# Altium schematic sheet IRF7317+TC4427.SchDoc
size A4
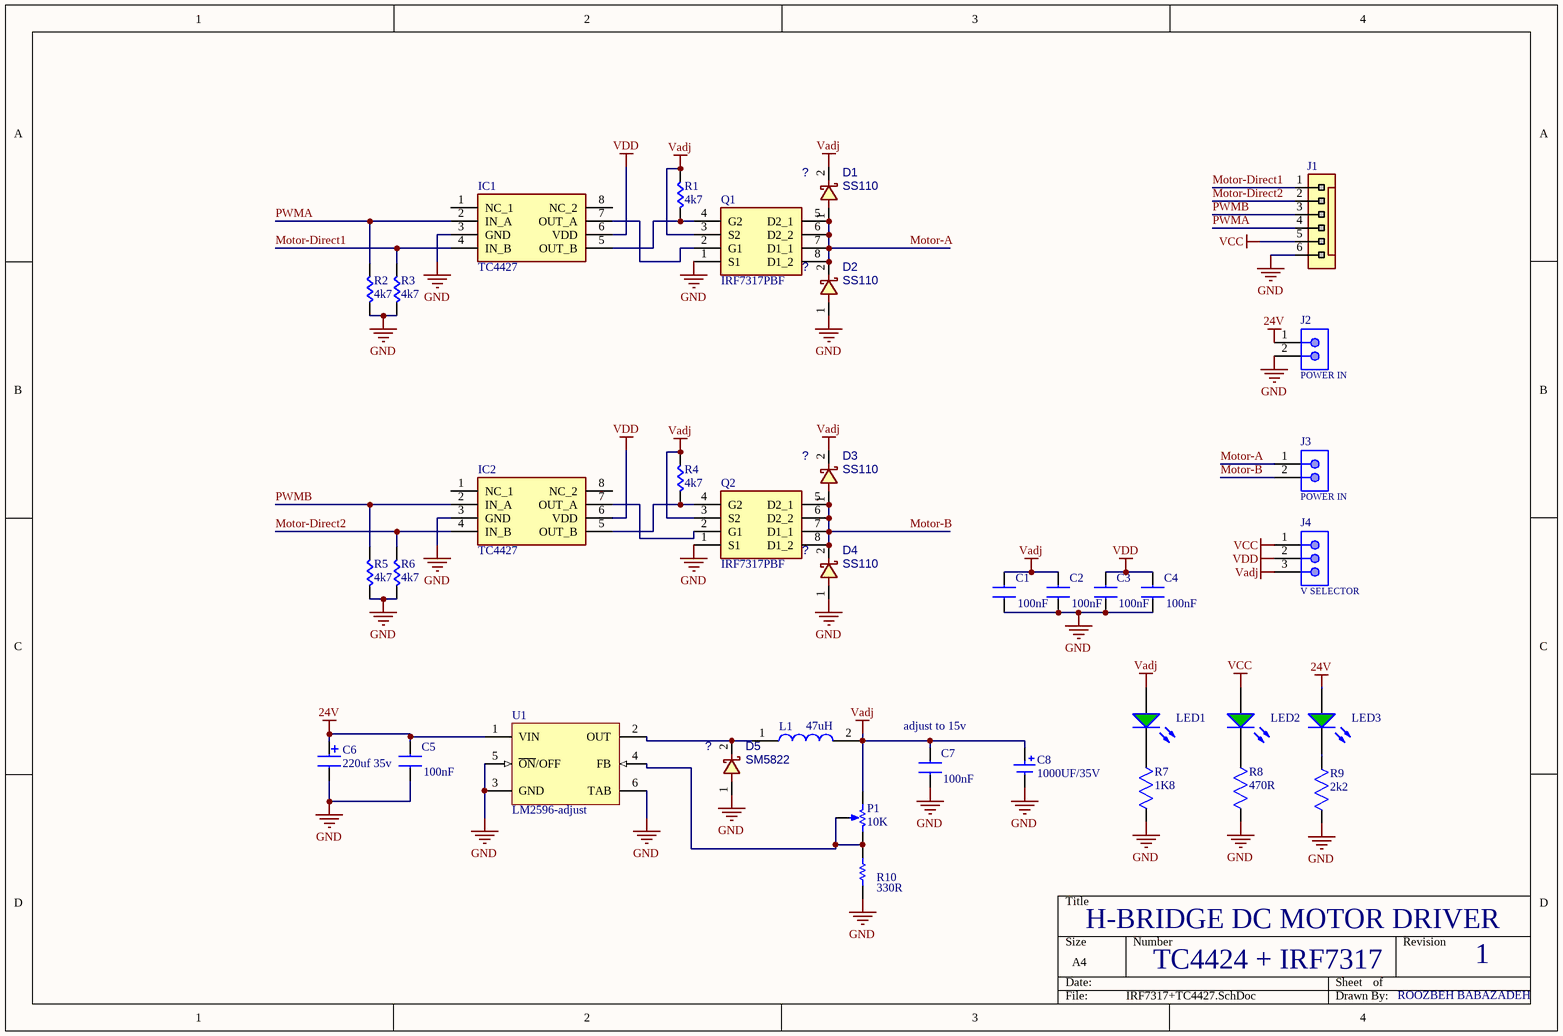
[diagram p0: IRF7317+TC4427.SchDoc]

## Parts
C1  100nF  [C0805]
C2  100nF  [C0805]
C3  100nF  [C0805]
C4  100nF  [C0805]
C5  100nF  [C0805]
C6  220uf 35v  [C_EL_10X12]
C7  100nF  [C0805]
C8  1000UF/35V  [C_EL_12X25]
D1  SS110  [D_SMA]
D2  SS110  [D_SMA]
D3  SS110  [D_SMA]
D4  SS110  [D_SMA]
D5  SM5822  [D_SMB]
IC1  TC4427  [SO_8]
IC2  TC4427  [SO_8]
J1  HDRWF_6  [WF_6]  (value not drawn)
J2  POWER IN  [PWL_2]
J3  POWER IN  [PWL_2]
J4  V SELECTOR  [3_SIP]
L1  47uH  [CDRH127LDNP560MC-12*12]
LED1  (no value)  [LED1206RED]
LED2  (no value)  [LED1206RED]
LED3  (no value)  [LED1206RED]
P1  10K  [POT_3296W]
Q1  IRF7317PBF  [SO_8]
Q2  IRF7317PBF  [SO_8]
R1  4k7  [R0805]
R2  4k7  [R0805]
R3  4k7  [R0805]
R4  4k7  [R0805]
R5  4k7  [R0805]
R6  4k7  [R0805]
R7  1K8  [R0805]
R8  470R  [R0805]
R9  2k2  [R0805]
R10  330R  [R0805]
U1  LM2596-adjust  [to-263-5 5d2pak LM2596S]

## Nets
24V: C5.2 C6.1 J2.1 LED3.1(A) U1.1(VIN)
GND: C1.1 C2.1 C3.1 C4.1 C5.1 C6.2 C7.1 C8.2 D2.1 D4.1 D5.1 IC1.3(GND) IC2.3(GND) J1.6 J2.2 Q1.1(S1) Q2.1(S1) R2.2 R3.2 R5.2 R6.2 R7.2 R8.2 R9.2 R10.1 U1.3(GND) U1.5(~{ON}/OFF) U1.6(TAB)
Vadj: C1.2 C2.2 C7.2 C8.1 D1.2 D3.2 J4.3 L1.2 LED1.1(A) P1.3(BOT) Q1.3(S2) Q2.3(S2) R1.1 R4.1
VCC: J1.5 J4.1 LED2.1(A)
VDD: C3.2 C4.2 IC1.6(VDD) IC2.6(VDD) J4.2
Motor-A: D1.1 D2.2 J3.1 Q1.5(D2_1) Q1.6(D2_2) Q1.7(D1_1) Q1.8(D1_2)
Motor-B: D3.1 D4.2 J3.2 Q2.5(D2_1) Q2.6(D2_2) Q2.7(D1_1) Q2.8(D1_2)
Motor-Direct1: IC1.4(IN_B) J1.1 R3.1
Motor-Direct2: IC2.4(IN_B) J1.2 R6.1
PWMA: IC1.2(IN_A) J1.4 R2.1
PWMB: IC2.2(IN_A) J1.3 R5.1
NetD5_2: D5.2 L1.1 U1.2(OUT)
NetIC1_5: IC1.5(OUT_B) Q1.4(G2) R1.2
NetIC1_7: IC1.7(OUT_A) Q1.2(G1)
NetIC2_5: IC2.5(OUT_B) Q2.4(G2) R4.2
NetIC2_7: IC2.7(OUT_A) Q2.2(G1)
NetLED1_2: LED1.2(K) R7.1
NetLED2_2: LED2.2(K) R8.1
NetLED3_2: LED3.2(K) R9.1
NetP1_1: P1.1(TOP) P1.2(TAP) R10.2 U1.4(FB)

Not connected (* = marked no-connect by the designer): IC1 1(NC_1) 8(NC_2); IC2 1(NC_1) 8(NC_2)

## Notes on the sheet
- (near C7) adjust to 15v
- H-BRIDGE DC MOTOR DRIVER
- TC4424 + IRF7317
- 1
- ROOZBEH BABAZADEH

## Library data of the parts
C1-C5 C7 = C
C6 = CAP3528
C8 = CAP_ELECTRO_POLIMER
D1-D5 = SCHOTTKY: DIODE, SCHOTTKY, 40V, 1A; MANF: DIODES; MANF_P#: 1N5819HW-7-F; DESC: DESCRIPTION; ASSEMBLY: ASSEMBLY; PRICE: PRICE; PARAM2: 1A; PARAM: 40V; VALUE: ?
IC1 IC2 = TC4427EOA713: Integrated Circuit; Manufacturer_Name: Microchip; Datasheet Link: http://www.microchip.com/mymicrochip/filehandler.aspx?ddocname=en011741; Height: 1.75mm; Manufacturer_Part_Number: TC4427EOA713; Arrow Part Number: TC4427EOA713; Arrow Price/Stock: https://www.arrow.com/en/products/tc4427eoa713/microchip-technology; Mouser Part Number: 579-TC4427EOA713; Mouser Price/Stock: https://www.mouser.co.uk/ProductDetail/Microchip-Technology/TC4427EOA713?qs=iwvYsH9bSFbKmD8r5x5IJg%3D%3D
J1 = HDRWF_6: Header, WF, Pitch: 2.54mm; VALUE: HDRWF_6
J2 J3 = sip 2: WR-PHD Pin Header, THT, pitch 2.54mm, Single Row, Vertical, 2pin; Part Number: 61300211121; Pin Number: 2; Gender: Male; Rated Current: 3A; Working Voltage: 250VAC; Withstanding Voltage: 500VAC; Contact Resistance: 20mOhm; ComponentLink1Description: Manufacturer; ComponentLink1URL: http://www.we-online.de; ComponentLink2Description: Datasheet; ComponentLink2URL: https://katalog.we-online.de/em/datasheet/6130xx11121.pdf; Published Date: June 2019; Publisher: Wurth Elektronik; Pitch: 2.54mm; Operating Temperature: -40 to +105degC; Mounting Technology: THT; Packaging: Bag; Row Number: Single; Orientation: Vertical
J4 = sip 3: WR-PHD Pin Header, THT, pitch 2.54mm, Single Row, Vertical, 3pin; Part Number: 61300311121; Pin Number: 3; Gender: Male; Rated Current: 3A; Working Voltage: 250VAC; Withstanding Voltage: 500VAC; Contact Resistance: 20mOhm; ComponentLink1Description: Manufacturer; ComponentLink1URL: http://www.we-online.de; ComponentLink2Description: Datasheet; ComponentLink2URL: https://katalog.we-online.de/em/datasheet/6130xx11121.pdf; Published Date: June 2019; Publisher: Wurth Elektronik; Pitch: 2.54mm; Operating Temperature: -40 to +105degC; Mounting Technology: THT; Packaging: Bag; Row Number: Single; Orientation: Vertical
L1 = CDRH127_LDNP-560MC: Inductor; Manufacturer_Name: Sumida; Manufacturer_Part_Number: CDRH127/LDNP-560MC; Datasheet Link: https://www.arrow.com/en/products/cdrh127ldnp-560mc/sumida; Height: 8mm; Arrow Part Number: CDRH127/LDNP-560MC; Arrow Price/Stock: https://www.arrow.com/en/products/cdrh127ldnp-560mc/sumida; Mouser Part Number: 851-CDRH127LDNP560MC; Mouser Price/Stock: https://www.mouser.co.uk/ProductDetail/Sumida/CDRH127-LDNP-560MC?qs=IXCoV6m%252B579ap3iATSRauQ%3D%3D
LED1-LED3 = LED3mm
P1 = Multi-Turn: Potentiometer
Q1 Q2 = IRF7317PBF: Transistor; Manufacturer_Name: Infineon; Datasheet Link: http://www.infineon.com/dgdl/irf7317pbf.pdf?fileId=5546d462533600a4015355f5b8de1b3d; Height: 1.75mm; Manufacturer_Part_Number: IRF7317PBF; Arrow Part Number: IRF7317PBF; Arrow Price/Stock: https://www.arrow.com/en/products/irf7317pbf/infineon-technologies-ag; Mouser Part Number: 942-IRF7317PBF; Mouser Price/Stock: https://www.mouser.com/Search/Refine.aspx?Keyword=942-IRF7317PBF
R1-R9 = R
R10 = Res1: Resistor; Published: 8-Jun-2000; LatestRevisionDate: 17-Jul-2002; LatestRevisionNote: Re-released for DXP Platform.; PackageReference: AXIAL-0.3; Publisher: Altium Limited; PackageDescription: Axial Device, Thru-Hole; 2 Leads; 0.3 in Pin Spacing; Value: 330R
U1 = LM2596s